# Altium schematic sheet LED.SchDoc
size 420 x 297 mm; SheetNumber: 13; SheetTotal: 19
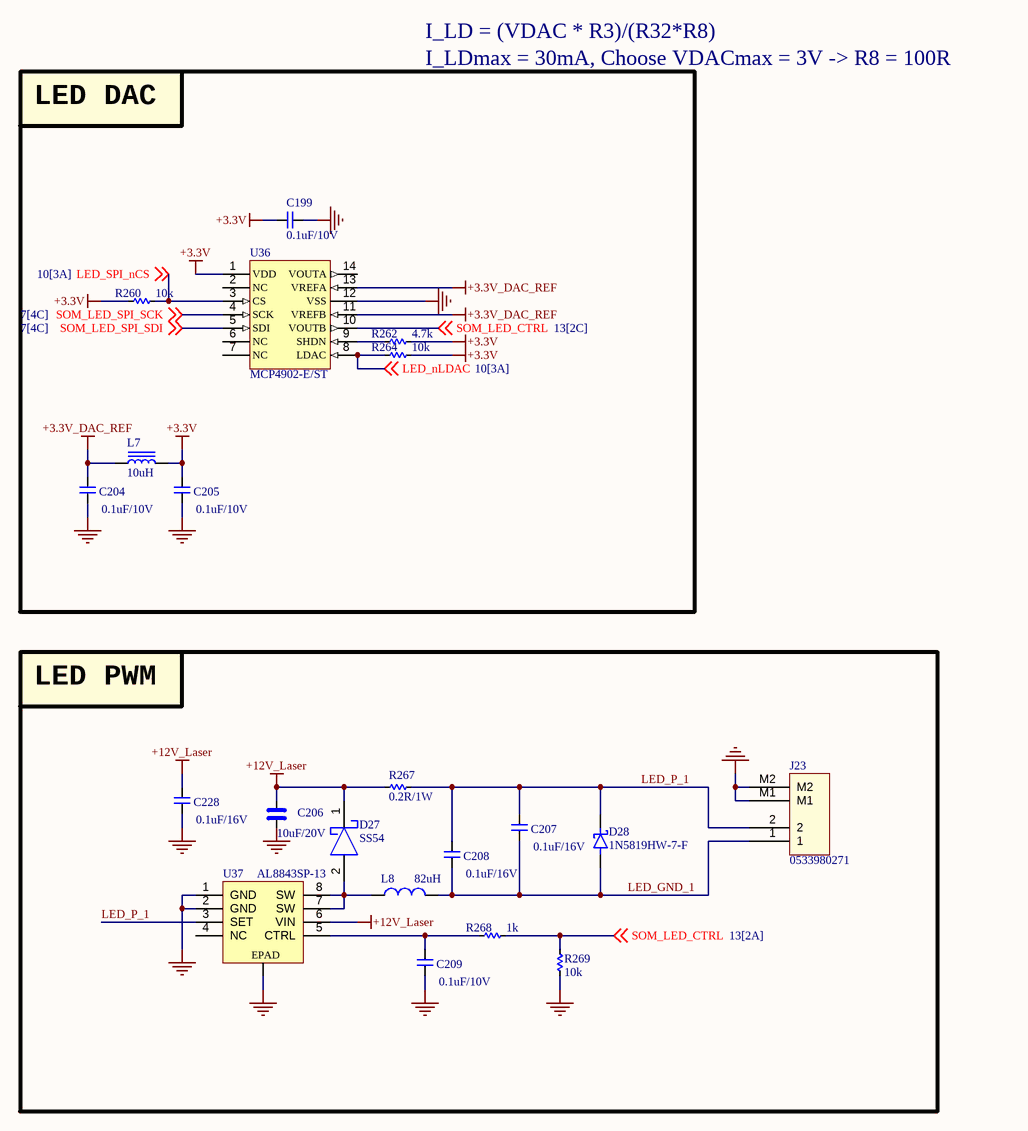
[diagram p0: LED.SchDoc]

## Parts
C199  0.1uF/10V  [CAP_C_1005X60]
C204  0.1uF/10V  [CAP_C_1005X60]
C205  0.1uF/10V  [CAP_C_1005X60]
C206  10uF/20V  [CAP_C_2012X110]
C207  0.1uF/16V  [CAP_C_1005X60]
C208  0.1uF/16V  [CAP_C_1005X60]
C209  0.1uF/10V  [CAP_C_1005X60]
C228  0.1uF/16V  [CAP_C_1005X60]
D27  SS54  [DO-214AC_SMA]
D28  1N5819HW-7-F  [SOD3717X145N]
J23  0533980271  [MOLEX_0533980271]
L7  10uH  [IND_C_2012X65]
L8  82uH  [L-SMD-M-4.8x4.8x2.8mm]
R260  10k  [RES_C_1005X40]
R262  4.7k  [RES_C_1005X40]
R264  10k  [RES_C_1005X40]
R267  0.2R/1W  [RES_C_3216X70]
R268  1k  [RES_C_1005X40]
R269  10k  [RES_C_1005X40]
U36  MCP4902-E/ST  [SOIC127P600X175-14N]
U37  AL8843SP-13  [SOIC127P602X173-8N_EPAD]

## Blocks framed on the sheet
LED DAC: C199 C204 C205 L7 R260 R262 R264 U36
LED PWM: C206-C209 C228 D27 D28 J23 L8 R267-R269 U37

## Nets
+3.3V: C199.2 C205.2 L7.2 R260.1 R262.2 R264.2 U36.1(VDD)
+3.3V_DAC_REF: C204.2 L7.1 U36.11(VREFB) U36.13(VREFA)
+12V_Laser: C206.1 C228.2 D27.1 R267.2 U37.6(VIN)
GND: C199.1 C204.1 C205.1 C206.2 C209.1 C228.1 J23.M1 J23.M2 R269.1 U36.12(VSS) U37.1(GND) U37.2(GND) U37.EPAD
LED_GND_1: C207.1 C208.1 D28.2(A) J23.1 L8.2
LED_nLDAC: R264.1 U36.8(LDAC) ; off-sheet LED_nLDAC
LED_P_1: C207.2 C208.2 D28.1(K) J23.2 R267.1 U37.3(SET)
LED_SPI_nCS: R260.2 U36.3(CS) ; off-sheet LED_SPI_nCS
SOM_LED_CTRL: R268.2 R269.2 U36.10(VOUTB) ; off-sheet SOM_LED_CTRL
SOM_LED_SPI_SCK: U36.4(SCK) ; off-sheet SOM_LED_SPI_SCK
SOM_LED_SPI_SDI: U36.5(SDI) ; off-sheet SOM_LED_SPI_SDI
NetC209_2: C209.2 R268.1 U37.5(CTRL)
NetD27_2: D27.2 L8.1 U37.7(SW) U37.8(SW)
NetR262_1: R262.1 U36.9(SHDN)

Not connected (* = marked no-connect by the designer): U36 2(NC) 6(NC) 7(NC) 14(VOUTA); U37 4(NC)

## Notes on the sheet
- I_LD = (VDAC * R3)/(R32*R8)
- I_LDmax = 30mA, Choose VDACmax = 3V -> R8 = 100R
- Project:
- Sub-system:
- Design by:
- Sheet title:
- Sheet
- of
- Checked by:
- Approved by:
- Revision:
- Document No:
- Size:
- Date:
- A3

## Library data of the parts
C199 C204 C205 C207-C209 C228 = _CAP_C_2: CAP CHIP
C206 = _CAP_C_High_2: CAP CHIP High Value
D27 = SS54: DIODE SCHOTTKY 60V 3A DO214AA
D28 = DIODE SCHOTTKY: DIODE SCHOTTKY 40V 1A SOD123
J23 = Header 2x1_2M
L7 = Inductor: MLZ1608N100LT000; Value: 1.5uH
L8 = L-SMD-1: SRR4828A-820M; partNo: 78477010; Manufacturer: Wurth Elektronik; Inductance: 1.0 μH; ComponentLink1Description: Manufacturer; ComponentLink1URL: http://www.we-online.de; Created by: Baojun Chen; Created Date: Nov.2015; ComponentLink2Description: Datasheet; ComponentLink2URL: http://katalog.we-online.de/pbs/datasheet/78477010.pdf
R260 R262 R264 R267-R269 = _RES_B_2: RES
U36 = MCP4902: IC DAC 8BIT V-OUT 14TSSOP
U37 = AL8843SP-13: IC LED DRIVER RGLTR PWM 3A 8SO